# Altium schematic sheet power.SchDoc
size A4
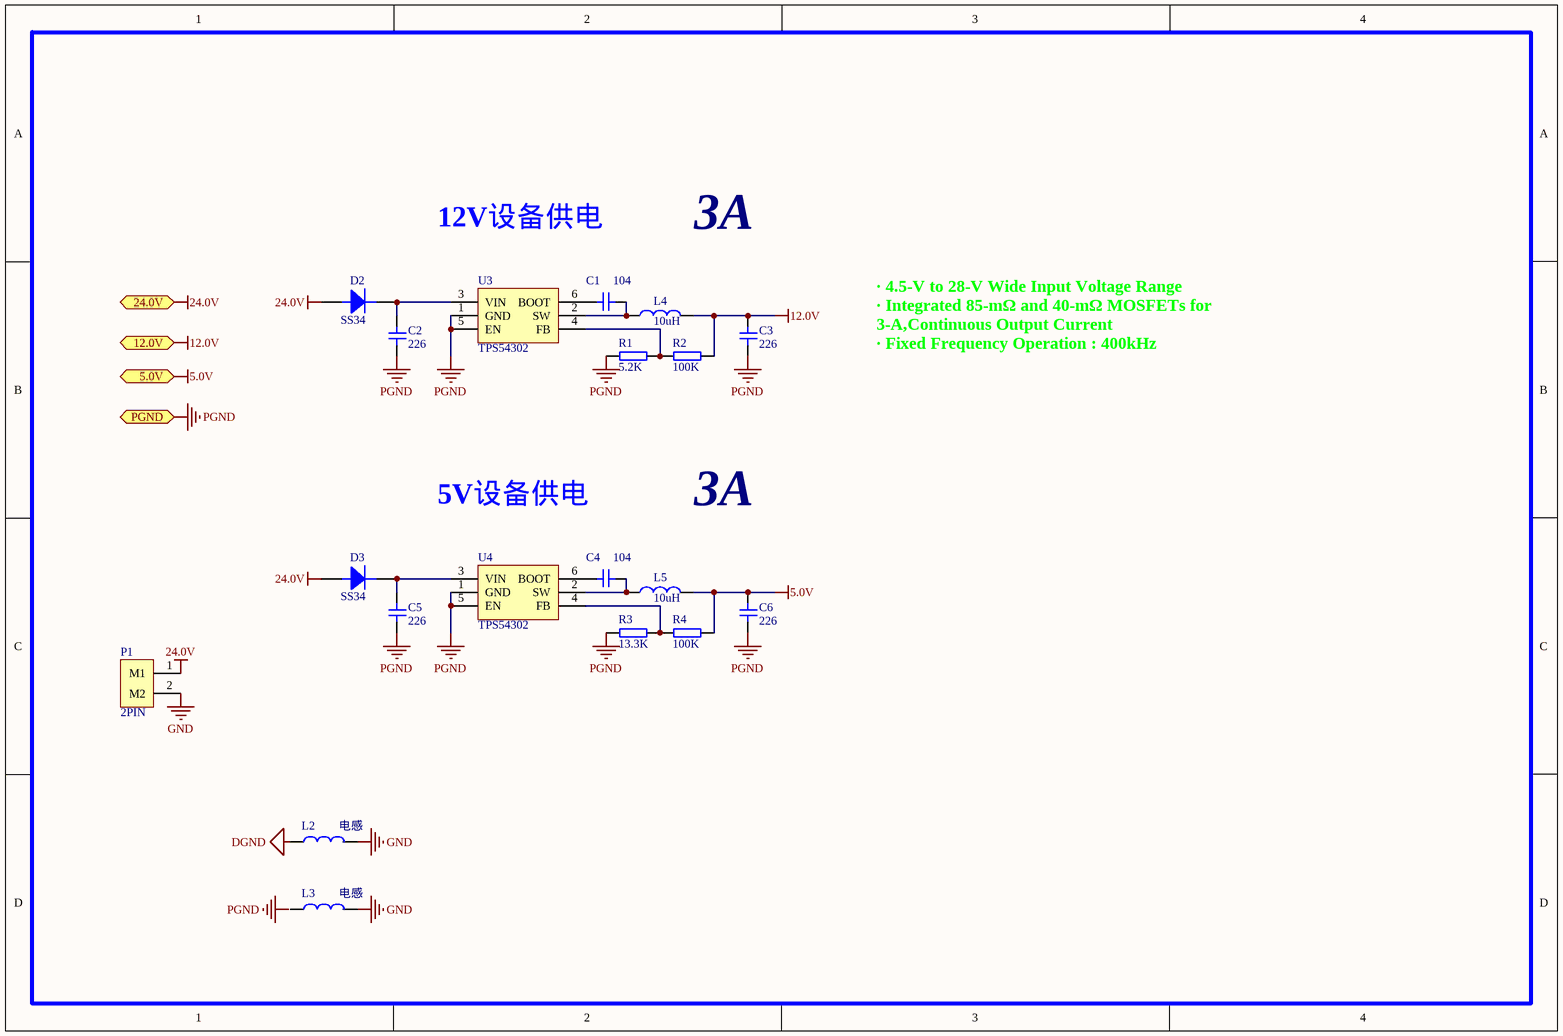
[diagram p0: power.SchDoc]

## Parts
C1  104  [0603C]
C2  226  [1206C]
C3  226  [0603C]
C4  104  [0603C]
C5  226  [1206C]
C6  226  [0603C]
D2  SS34  [SMA/DO-214AC]
D3  SS34  [SMA/DO-214AC]
L2  电感  [1206L]
L3  电感  [1206L]
L4  10uH  [0630L]
L5  10uH  [0630L]
P1  2PIN  [KF350-2P]
R1  5.2K  [0603R]
R2  100K  [0603R]
R3  13.3K  [0603R]
R4  100K  [0603R]
U3  TPS54302  [SOT23-6]
U4  TPS54302  [SOT23-6]

## Ports
5.0V (out), 12.0V (out), 24.0V (in), PGND (in)

## Nets
5.0V: C6.2 L5.2 R4.1 ; port 5.0V
12.0V: C3.2 L4.2 R2.1 ; port 12.0V
24.0V: D2.1 D3.1 P1.1(M1) ; port 24.0V
DGND: L2.1
GND: L2.2 L3.2 P1.2(M2)
PGND: C2.1 C3.1 C5.1 C6.1 R1.2 R3.2 U3.1(GND) U3.5(EN) U4.1(GND) U4.5(EN) ; port PGND
NetC1_1: C1.1 L4.1 U3.2(SW)
NetC1_2: C1.2 U3.6(BOOT)
NetC2_2: C2.2 D2.2 U3.3(VIN)
NetC4_1: C4.1 L5.1 U4.2(SW)
NetC4_2: C4.2 U4.6(BOOT)
NetC5_2: C5.2 D3.2 U4.3(VIN)
NetR1_1: R1.1 R2.2 U3.4(FB)
NetR3_1: R3.1 R4.2 U4.4(FB)

Not connected (* = marked no-connect by the designer): L3 1

## Notes on the sheet
- 12V设备供电
- 3A
- · 4.5-V to 28-V Wide Input Voltage Range
  · Integrated 85-mΩ and 40-mΩ MOSFETs for 3-A,Continuous Output Current
  · Fixed Frequency Operation : 400kHz
- 5V设备供电
- Labels drawn without touching a wire or pin: PGND

## Library data of the parts
C1-C6 = Cap1: 无极贴片电容
D2 D3 = Diode: 二极管
L2 L3 = L
L4 L5 = L: 电感
P1 = 接线端子-2PIN
R1-R4 = Res: 电阻